# EAGLE schematic esp32Stack (EAGLE 7.7.0)
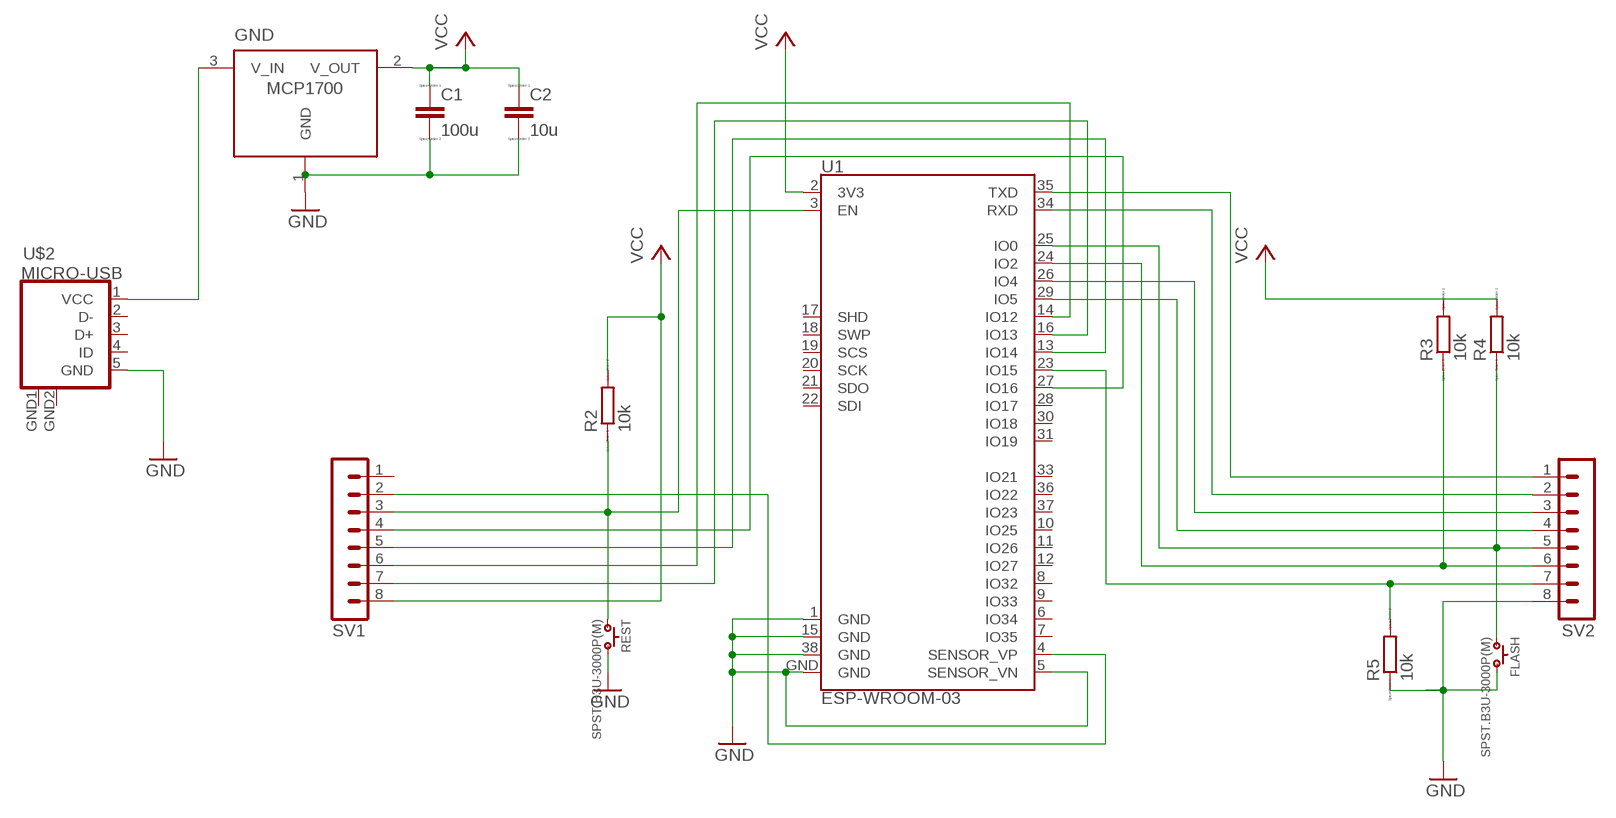
[diagram p0: schematic, sheet 1]

## Parts
C1  100u  C  [C0805]
C2  10u  C  [C0805]
FLASH  SPST.B3U-3000P(M)  [B3U-3000P(M)]
GND  MCP1700SOT23  [SOT-23]
R2  10k  R  [R0805]
R3  10k  R  [R0805]
R4  10k  R  [R0805]
R5  10k  R  [R0805]
REST  SPST.B3U-3000P(M)  [B3U-3000P(M)]
SV1  MA08-1  [MA08-1]
SV2  MA08-1  [MA08-1]
U1  ESP-WROOM-03  [ESP-WROOM-03]
U$2  MICRO-USB  [MICRO-USB]

## Nets
ADC: SV1.2 U1.4(SENSOR_VP)
EN: R2.1 REST.1 SV1.3 U1.3(EN)
GND: C1.2 C2.2 FLASH.2 GND.1(GND) R5.1 REST.2 SV2.8 U1.1(GND) U1.5(SENSOR_VN) U1.15(GND) U1.38(GND) U1.GND U$2.5(GND)
GPIO0: FLASH.1 R4.1 SV2.5 U1.25(IO0)
GPIO2: R3.1 SV2.6 U1.24(IO2)
GPIO4: SV2.4 U1.29(IO5)
GPIO5: SV2.3 U1.26(IO4)
GPIO12: SV1.6 U1.14(IO12)
GPIO13: SV1.7 U1.16(IO13)
GPIO14: SV1.4 U1.27(IO16)
GPIO15: R5.2 SV2.7 U1.23(IO15)
N$1: SV2.1 U1.35(TXD)
N$2: SV2.2 U1.34(RXD)
N$3: SV1.5 U1.13(IO14)
N$4: GND.3(V_IN) U$2.1(VCC)
VCC/V3.3: C1.1 C2.1 GND.2(V_OUT) R2.2 R3.2 R4.2 SV1.8 U1.2(3V3) ; supply symbol labelled VCC
Unconnected: SV1.1 U1.6(IO34) U1.7(IO35) U1.8(IO32) U1.9(IO33) U1.10(IO25) U1.11(IO26) U1.12(IO27) U1.17(SHD) U1.18(SWP) U1.19(SCS) U1.20(SCK) U1.21(SDO) U1.22(SDI) U1.28(IO17) U1.30(IO18) U1.31(IO19) U1.33(IO21) U1.36(IO22) U1.37(IO23) U$2.2(D-) U$2.3(D+) U$2.4(ID)

## Power pins joined to a net without a drawn wire
GND: U$2.GND1(GND) U$2.GND2(GND)

## Library data of the parts
C1 C2 = eagle-ltspice:C: CAPACITOR, European symbol; SPICEMODEL: NONE; SPICEPREFIX: C
FLASH REST = omron:SPST
GND = MCP1700:MCP1700SOT23
R2-R5 = eagle-ltspice:R: RESISTOR, European symbol; SPICEMODEL: NONE; SPICEPREFIX: R
SV1 SV2 = con-lstb:MA08-1: PIN HEADER; OC_FARNELL: unknown; OC_NEWARK: unknown
U1 = esp32:ESP-WROOM-03
U$2 = microusb (1):MICRO-USB: Micro USB B connector